# Altium project Service_board.PrjPcb (part 8 of 9)
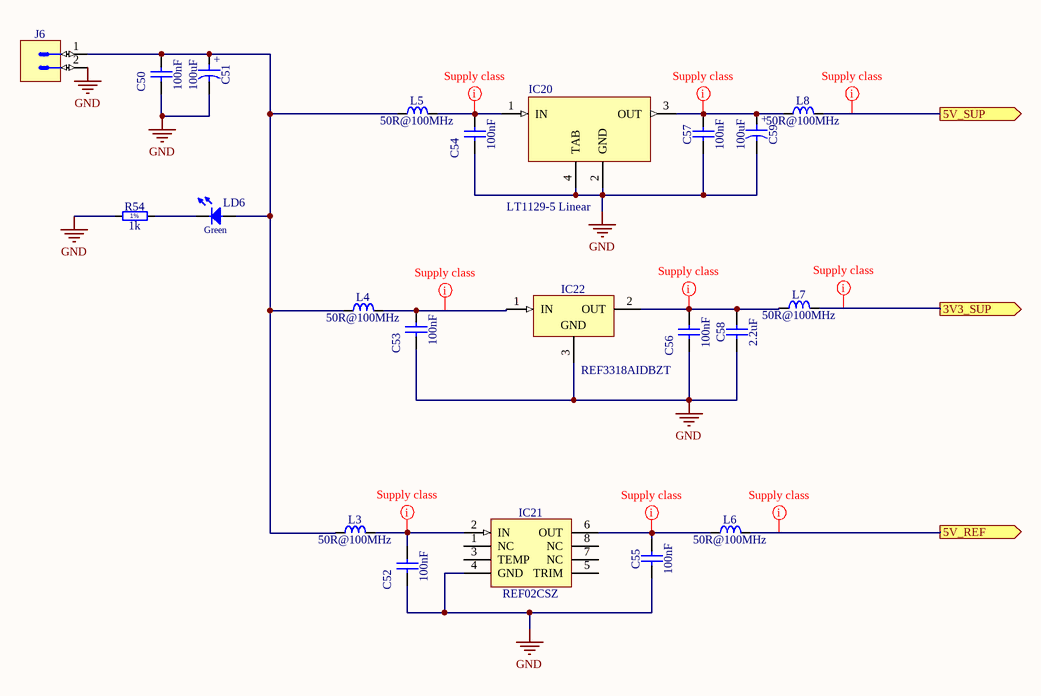
[diagram p13: Regulators.SchDoc]

## Nets that join several sheets (continued)
NetIC2_U_Bank_U_Channel#11_7: U_Bank/U_Channel (IC2_U_Bank_U_Channel#11.7), U_Bank/U_Channel/U_Switch (IC13_U_Bank_U_Channel_U_Switch#22.4 R33_U_Bank_U_Channel_U_Switch#22.2)
NetIC2_U_Bank_U_Channel#11_8: U_Bank/U_Channel (IC2_U_Bank_U_Channel#11.8), U_Bank/U_Channel/U_Switch (IC15_U_Bank_U_Channel_U_Switch#21.5 LD5_U_Bank_U_Channel_U_Switch#21.2 T7_U_Bank_U_Channel_U_Switch#21.1)
NetIC2_U_Bank_U_Channel#11_11: U_Bank/U_Channel (IC2_U_Bank_U_Channel#11.11), U_Bank/U_Channel/U_Switch (IC15_U_Bank_U_Channel_U_Switch#22.5 LD5_U_Bank_U_Channel_U_Switch#22.2 T7_U_Bank_U_Channel_U_Switch#22.1)
NetIC2_U_Bank_U_Channel#11_14: U_Bank/U_Channel (IC2_U_Bank_U_Channel#11.14), U_Bank/U_Channel/U_Switch (IC13_U_Bank_U_Channel_U_Switch#21.4 R33_U_Bank_U_Channel_U_Switch#21.2)
NetIC2_U_Bank_U_Channel#11_16: U_Bank/U_Channel (IC2_U_Bank_U_Channel#11.16), U_Bank/U_Channel/U_Switch (R45_U_Bank_U_Channel_U_Switch#21.2)
NetIC2_U_Bank_U_Channel#11_18: U_Bank/U_Channel (IC2_U_Bank_U_Channel#11.18), U_Bank/U_Channel/U_Switch (R46_U_Bank_U_Channel_U_Switch#21.2)
NetIC2_U_Bank_U_Channel#12_3: U_Bank/U_Channel (IC2_U_Bank_U_Channel#12.3), U_Bank/U_Channel/U_Switch (R46_U_Bank_U_Channel_U_Switch#24.2)
NetIC2_U_Bank_U_Channel#12_5: U_Bank/U_Channel (IC2_U_Bank_U_Channel#12.5), U_Bank/U_Channel/U_Switch (R45_U_Bank_U_Channel_U_Switch#24.2)
NetIC2_U_Bank_U_Channel#12_7: U_Bank/U_Channel (IC2_U_Bank_U_Channel#12.7), U_Bank/U_Channel/U_Switch (IC13_U_Bank_U_Channel_U_Switch#24.4 R33_U_Bank_U_Channel_U_Switch#24.2)
NetIC2_U_Bank_U_Channel#12_8: U_Bank/U_Channel (IC2_U_Bank_U_Channel#12.8), U_Bank/U_Channel/U_Switch (IC15_U_Bank_U_Channel_U_Switch#23.5 LD5_U_Bank_U_Channel_U_Switch#23.2 T7_U_Bank_U_Channel_U_Switch#23.1)
NetIC2_U_Bank_U_Channel#12_11: U_Bank/U_Channel (IC2_U_Bank_U_Channel#12.11), U_Bank/U_Channel/U_Switch (IC15_U_Bank_U_Channel_U_Switch#24.5 LD5_U_Bank_U_Channel_U_Switch#24.2 T7_U_Bank_U_Channel_U_Switch#24.1)
NetIC2_U_Bank_U_Channel#12_14: U_Bank/U_Channel (IC2_U_Bank_U_Channel#12.14), U_Bank/U_Channel/U_Switch (IC13_U_Bank_U_Channel_U_Switch#23.4 R33_U_Bank_U_Channel_U_Switch#23.2)
NetIC2_U_Bank_U_Channel#12_16: U_Bank/U_Channel (IC2_U_Bank_U_Channel#12.16), U_Bank/U_Channel/U_Switch (R45_U_Bank_U_Channel_U_Switch#23.2)
NetIC2_U_Bank_U_Channel#12_18: U_Bank/U_Channel (IC2_U_Bank_U_Channel#12.18), U_Bank/U_Channel/U_Switch (R46_U_Bank_U_Channel_U_Switch#23.2)
NetIC2_U_Bank_U_Channel#13_3: U_Bank/U_Channel (IC2_U_Bank_U_Channel#13.3), U_Bank/U_Channel/U_Switch (R46_U_Bank_U_Channel_U_Switch#26.2)
NetIC2_U_Bank_U_Channel#13_5: U_Bank/U_Channel (IC2_U_Bank_U_Channel#13.5), U_Bank/U_Channel/U_Switch (R45_U_Bank_U_Channel_U_Switch#26.2)
NetIC2_U_Bank_U_Channel#13_7: U_Bank/U_Channel (IC2_U_Bank_U_Channel#13.7), U_Bank/U_Channel/U_Switch (IC13_U_Bank_U_Channel_U_Switch#26.4 R33_U_Bank_U_Channel_U_Switch#26.2)
NetIC2_U_Bank_U_Channel#13_8: U_Bank/U_Channel (IC2_U_Bank_U_Channel#13.8), U_Bank/U_Channel/U_Switch (IC15_U_Bank_U_Channel_U_Switch#25.5 LD5_U_Bank_U_Channel_U_Switch#25.2 T7_U_Bank_U_Channel_U_Switch#25.1)
NetIC2_U_Bank_U_Channel#13_11: U_Bank/U_Channel (IC2_U_Bank_U_Channel#13.11), U_Bank/U_Channel/U_Switch (IC15_U_Bank_U_Channel_U_Switch#26.5 LD5_U_Bank_U_Channel_U_Switch#26.2 T7_U_Bank_U_Channel_U_Switch#26.1)
NetIC2_U_Bank_U_Channel#13_14: U_Bank/U_Channel (IC2_U_Bank_U_Channel#13.14), U_Bank/U_Channel/U_Switch (IC13_U_Bank_U_Channel_U_Switch#25.4 R33_U_Bank_U_Channel_U_Switch#25.2)
NetIC2_U_Bank_U_Channel#13_16: U_Bank/U_Channel (IC2_U_Bank_U_Channel#13.16), U_Bank/U_Channel/U_Switch (R45_U_Bank_U_Channel_U_Switch#25.2)
NetIC2_U_Bank_U_Channel#13_18: U_Bank/U_Channel (IC2_U_Bank_U_Channel#13.18), U_Bank/U_Channel/U_Switch (R46_U_Bank_U_Channel_U_Switch#25.2)
NetIC2_U_Bank_U_Channel#14_3: U_Bank/U_Channel (IC2_U_Bank_U_Channel#14.3), U_Bank/U_Channel/U_Switch (R46_U_Bank_U_Channel_U_Switch#28.2)
NetIC2_U_Bank_U_Channel#14_5: U_Bank/U_Channel (IC2_U_Bank_U_Channel#14.5), U_Bank/U_Channel/U_Switch (R45_U_Bank_U_Channel_U_Switch#28.2)
NetIC2_U_Bank_U_Channel#14_7: U_Bank/U_Channel (IC2_U_Bank_U_Channel#14.7), U_Bank/U_Channel/U_Switch (IC13_U_Bank_U_Channel_U_Switch#28.4 R33_U_Bank_U_Channel_U_Switch#28.2)
NetIC2_U_Bank_U_Channel#14_8: U_Bank/U_Channel (IC2_U_Bank_U_Channel#14.8), U_Bank/U_Channel/U_Switch (IC15_U_Bank_U_Channel_U_Switch#27.5 LD5_U_Bank_U_Channel_U_Switch#27.2 T7_U_Bank_U_Channel_U_Switch#27.1)
NetIC2_U_Bank_U_Channel#14_11: U_Bank/U_Channel (IC2_U_Bank_U_Channel#14.11), U_Bank/U_Channel/U_Switch (IC15_U_Bank_U_Channel_U_Switch#28.5 LD5_U_Bank_U_Channel_U_Switch#28.2 T7_U_Bank_U_Channel_U_Switch#28.1)
NetIC2_U_Bank_U_Channel#14_14: U_Bank/U_Channel (IC2_U_Bank_U_Channel#14.14), U_Bank/U_Channel/U_Switch (IC13_U_Bank_U_Channel_U_Switch#27.4 R33_U_Bank_U_Channel_U_Switch#27.2)
NetIC2_U_Bank_U_Channel#14_16: U_Bank/U_Channel (IC2_U_Bank_U_Channel#14.16), U_Bank/U_Channel/U_Switch (R45_U_Bank_U_Channel_U_Switch#27.2)
NetIC2_U_Bank_U_Channel#14_18: U_Bank/U_Channel (IC2_U_Bank_U_Channel#14.18), U_Bank/U_Channel/U_Switch (R46_U_Bank_U_Channel_U_Switch#27.2)
NetIC2_U_Bank_U_Channel#15_3: U_Bank/U_Channel (IC2_U_Bank_U_Channel#15.3), U_Bank/U_Channel/U_Switch (R46_U_Bank_U_Channel_U_Switch#30.2)
NetIC2_U_Bank_U_Channel#15_5: U_Bank/U_Channel (IC2_U_Bank_U_Channel#15.5), U_Bank/U_Channel/U_Switch (R45_U_Bank_U_Channel_U_Switch#30.2)
NetIC2_U_Bank_U_Channel#15_7: U_Bank/U_Channel (IC2_U_Bank_U_Channel#15.7), U_Bank/U_Channel/U_Switch (IC13_U_Bank_U_Channel_U_Switch#30.4 R33_U_Bank_U_Channel_U_Switch#30.2)
NetIC2_U_Bank_U_Channel#15_8: U_Bank/U_Channel (IC2_U_Bank_U_Channel#15.8), U_Bank/U_Channel/U_Switch (IC15_U_Bank_U_Channel_U_Switch#29.5 LD5_U_Bank_U_Channel_U_Switch#29.2 T7_U_Bank_U_Channel_U_Switch#29.1)
NetIC2_U_Bank_U_Channel#15_11: U_Bank/U_Channel (IC2_U_Bank_U_Channel#15.11), U_Bank/U_Channel/U_Switch (IC15_U_Bank_U_Channel_U_Switch#30.5 LD5_U_Bank_U_Channel_U_Switch#30.2 T7_U_Bank_U_Channel_U_Switch#30.1)
NetIC2_U_Bank_U_Channel#15_14: U_Bank/U_Channel (IC2_U_Bank_U_Channel#15.14), U_Bank/U_Channel/U_Switch (IC13_U_Bank_U_Channel_U_Switch#29.4 R33_U_Bank_U_Channel_U_Switch#29.2)
NetIC2_U_Bank_U_Channel#15_16: U_Bank/U_Channel (IC2_U_Bank_U_Channel#15.16), U_Bank/U_Channel/U_Switch (R45_U_Bank_U_Channel_U_Switch#29.2)
NetIC2_U_Bank_U_Channel#15_18: U_Bank/U_Channel (IC2_U_Bank_U_Channel#15.18), U_Bank/U_Channel/U_Switch (R46_U_Bank_U_Channel_U_Switch#29.2)
NetIC2_U_Bank_U_Channel#16_3: U_Bank/U_Channel (IC2_U_Bank_U_Channel#16.3), U_Bank/U_Channel/U_Switch (R46_U_Bank_U_Channel_U_Switch#32.2)
NetIC2_U_Bank_U_Channel#16_5: U_Bank/U_Channel (IC2_U_Bank_U_Channel#16.5), U_Bank/U_Channel/U_Switch (R45_U_Bank_U_Channel_U_Switch#32.2)
NetIC2_U_Bank_U_Channel#16_7: U_Bank/U_Channel (IC2_U_Bank_U_Channel#16.7), U_Bank/U_Channel/U_Switch (IC13_U_Bank_U_Channel_U_Switch#32.4 R33_U_Bank_U_Channel_U_Switch#32.2)
NetIC2_U_Bank_U_Channel#16_8: U_Bank/U_Channel (IC2_U_Bank_U_Channel#16.8), U_Bank/U_Channel/U_Switch (IC15_U_Bank_U_Channel_U_Switch#31.5 LD5_U_Bank_U_Channel_U_Switch#31.2 T7_U_Bank_U_Channel_U_Switch#31.1)
NetIC2_U_Bank_U_Channel#16_11: U_Bank/U_Channel (IC2_U_Bank_U_Channel#16.11), U_Bank/U_Channel/U_Switch (IC15_U_Bank_U_Channel_U_Switch#32.5 LD5_U_Bank_U_Channel_U_Switch#32.2 T7_U_Bank_U_Channel_U_Switch#32.1)
NetIC2_U_Bank_U_Channel#16_14: U_Bank/U_Channel (IC2_U_Bank_U_Channel#16.14), U_Bank/U_Channel/U_Switch (IC13_U_Bank_U_Channel_U_Switch#31.4 R33_U_Bank_U_Channel_U_Switch#31.2)
NetIC2_U_Bank_U_Channel#16_16: U_Bank/U_Channel (IC2_U_Bank_U_Channel#16.16), U_Bank/U_Channel/U_Switch (R45_U_Bank_U_Channel_U_Switch#31.2)
NetIC2_U_Bank_U_Channel#16_18: U_Bank/U_Channel (IC2_U_Bank_U_Channel#16.18), U_Bank/U_Channel/U_Switch (R46_U_Bank_U_Channel_U_Switch#31.2)
NetIC2_U_Bank_U_Channel#17_3: U_Bank/U_Channel (IC2_U_Bank_U_Channel#17.3), U_Bank/U_Channel/U_Switch (R46_U_Bank_U_Channel_U_Switch#34.2)
NetIC2_U_Bank_U_Channel#17_5: U_Bank/U_Channel (IC2_U_Bank_U_Channel#17.5), U_Bank/U_Channel/U_Switch (R45_U_Bank_U_Channel_U_Switch#34.2)
NetIC2_U_Bank_U_Channel#17_7: U_Bank/U_Channel (IC2_U_Bank_U_Channel#17.7), U_Bank/U_Channel/U_Switch (IC13_U_Bank_U_Channel_U_Switch#34.4 R33_U_Bank_U_Channel_U_Switch#34.2)
NetIC2_U_Bank_U_Channel#17_8: U_Bank/U_Channel (IC2_U_Bank_U_Channel#17.8), U_Bank/U_Channel/U_Switch (IC15_U_Bank_U_Channel_U_Switch#33.5 LD5_U_Bank_U_Channel_U_Switch#33.2 T7_U_Bank_U_Channel_U_Switch#33.1)
NetIC2_U_Bank_U_Channel#17_11: U_Bank/U_Channel (IC2_U_Bank_U_Channel#17.11), U_Bank/U_Channel/U_Switch (IC15_U_Bank_U_Channel_U_Switch#34.5 LD5_U_Bank_U_Channel_U_Switch#34.2 T7_U_Bank_U_Channel_U_Switch#34.1)
NetIC2_U_Bank_U_Channel#17_14: U_Bank/U_Channel (IC2_U_Bank_U_Channel#17.14), U_Bank/U_Channel/U_Switch (IC13_U_Bank_U_Channel_U_Switch#33.4 R33_U_Bank_U_Channel_U_Switch#33.2)
NetIC2_U_Bank_U_Channel#17_16: U_Bank/U_Channel (IC2_U_Bank_U_Channel#17.16), U_Bank/U_Channel/U_Switch (R45_U_Bank_U_Channel_U_Switch#33.2)
NetIC2_U_Bank_U_Channel#17_18: U_Bank/U_Channel (IC2_U_Bank_U_Channel#17.18), U_Bank/U_Channel/U_Switch (R46_U_Bank_U_Channel_U_Switch#33.2)
NetIC2_U_Bank_U_Channel#18_3: U_Bank/U_Channel (IC2_U_Bank_U_Channel#18.3), U_Bank/U_Channel/U_Switch (R46_U_Bank_U_Channel_U_Switch#36.2)
NetIC2_U_Bank_U_Channel#18_5: U_Bank/U_Channel (IC2_U_Bank_U_Channel#18.5), U_Bank/U_Channel/U_Switch (R45_U_Bank_U_Channel_U_Switch#36.2)
NetIC2_U_Bank_U_Channel#18_7: U_Bank/U_Channel (IC2_U_Bank_U_Channel#18.7), U_Bank/U_Channel/U_Switch (IC13_U_Bank_U_Channel_U_Switch#36.4 R33_U_Bank_U_Channel_U_Switch#36.2)
NetIC2_U_Bank_U_Channel#18_8: U_Bank/U_Channel (IC2_U_Bank_U_Channel#18.8), U_Bank/U_Channel/U_Switch (IC15_U_Bank_U_Channel_U_Switch#35.5 LD5_U_Bank_U_Channel_U_Switch#35.2 T7_U_Bank_U_Channel_U_Switch#35.1)
NetIC2_U_Bank_U_Channel#18_11: U_Bank/U_Channel (IC2_U_Bank_U_Channel#18.11), U_Bank/U_Channel/U_Switch (IC15_U_Bank_U_Channel_U_Switch#36.5 LD5_U_Bank_U_Channel_U_Switch#36.2 T7_U_Bank_U_Channel_U_Switch#36.1)
NetIC2_U_Bank_U_Channel#18_14: U_Bank/U_Channel (IC2_U_Bank_U_Channel#18.14), U_Bank/U_Channel/U_Switch (IC13_U_Bank_U_Channel_U_Switch#35.4 R33_U_Bank_U_Channel_U_Switch#35.2)
NetIC2_U_Bank_U_Channel#18_16: U_Bank/U_Channel (IC2_U_Bank_U_Channel#18.16), U_Bank/U_Channel/U_Switch (R45_U_Bank_U_Channel_U_Switch#35.2)
NetIC2_U_Bank_U_Channel#18_18: U_Bank/U_Channel (IC2_U_Bank_U_Channel#18.18), U_Bank/U_Channel/U_Switch (R46_U_Bank_U_Channel_U_Switch#35.2)
NetIC2_U_Bank_U_Channel#19_3: U_Bank/U_Channel (IC2_U_Bank_U_Channel#19.3), U_Bank/U_Channel/U_Switch (R46_U_Bank_U_Channel_U_Switch#38.2)
NetIC2_U_Bank_U_Channel#19_5: U_Bank/U_Channel (IC2_U_Bank_U_Channel#19.5), U_Bank/U_Channel/U_Switch (R45_U_Bank_U_Channel_U_Switch#38.2)
NetIC2_U_Bank_U_Channel#19_7: U_Bank/U_Channel (IC2_U_Bank_U_Channel#19.7), U_Bank/U_Channel/U_Switch (IC13_U_Bank_U_Channel_U_Switch#38.4 R33_U_Bank_U_Channel_U_Switch#38.2)
NetIC2_U_Bank_U_Channel#19_8: U_Bank/U_Channel (IC2_U_Bank_U_Channel#19.8), U_Bank/U_Channel/U_Switch (IC15_U_Bank_U_Channel_U_Switch#37.5 LD5_U_Bank_U_Channel_U_Switch#37.2 T7_U_Bank_U_Channel_U_Switch#37.1)
NetIC2_U_Bank_U_Channel#19_11: U_Bank/U_Channel (IC2_U_Bank_U_Channel#19.11), U_Bank/U_Channel/U_Switch (IC15_U_Bank_U_Channel_U_Switch#38.5 LD5_U_Bank_U_Channel_U_Switch#38.2 T7_U_Bank_U_Channel_U_Switch#38.1)
NetIC2_U_Bank_U_Channel#19_14: U_Bank/U_Channel (IC2_U_Bank_U_Channel#19.14), U_Bank/U_Channel/U_Switch (IC13_U_Bank_U_Channel_U_Switch#37.4 R33_U_Bank_U_Channel_U_Switch#37.2)
NetIC2_U_Bank_U_Channel#19_16: U_Bank/U_Channel (IC2_U_Bank_U_Channel#19.16), U_Bank/U_Channel/U_Switch (R45_U_Bank_U_Channel_U_Switch#37.2)
NetIC2_U_Bank_U_Channel#19_18: U_Bank/U_Channel (IC2_U_Bank_U_Channel#19.18), U_Bank/U_Channel/U_Switch (R46_U_Bank_U_Channel_U_Switch#37.2)
NetIC2_U_Bank_U_Channel#20_3: U_Bank/U_Channel (IC2_U_Bank_U_Channel#20.3), U_Bank/U_Channel/U_Switch (R46_U_Bank_U_Channel_U_Switch#40.2)
NetIC2_U_Bank_U_Channel#20_5: U_Bank/U_Channel (IC2_U_Bank_U_Channel#20.5), U_Bank/U_Channel/U_Switch (R45_U_Bank_U_Channel_U_Switch#40.2)
NetIC2_U_Bank_U_Channel#20_7: U_Bank/U_Channel (IC2_U_Bank_U_Channel#20.7), U_Bank/U_Channel/U_Switch (IC13_U_Bank_U_Channel_U_Switch#40.4 R33_U_Bank_U_Channel_U_Switch#40.2)
NetIC2_U_Bank_U_Channel#20_8: U_Bank/U_Channel (IC2_U_Bank_U_Channel#20.8), U_Bank/U_Channel/U_Switch (IC15_U_Bank_U_Channel_U_Switch#39.5 LD5_U_Bank_U_Channel_U_Switch#39.2 T7_U_Bank_U_Channel_U_Switch#39.1)
NetIC2_U_Bank_U_Channel#20_11: U_Bank/U_Channel (IC2_U_Bank_U_Channel#20.11), U_Bank/U_Channel/U_Switch (IC15_U_Bank_U_Channel_U_Switch#40.5 LD5_U_Bank_U_Channel_U_Switch#40.2 T7_U_Bank_U_Channel_U_Switch#40.1)
NetIC2_U_Bank_U_Channel#20_14: U_Bank/U_Channel (IC2_U_Bank_U_Channel#20.14), U_Bank/U_Channel/U_Switch (IC13_U_Bank_U_Channel_U_Switch#39.4 R33_U_Bank_U_Channel_U_Switch#39.2)
NetIC2_U_Bank_U_Channel#20_16: U_Bank/U_Channel (IC2_U_Bank_U_Channel#20.16), U_Bank/U_Channel/U_Switch (R45_U_Bank_U_Channel_U_Switch#39.2)
NetIC2_U_Bank_U_Channel#20_18: U_Bank/U_Channel (IC2_U_Bank_U_Channel#20.18), U_Bank/U_Channel/U_Switch (R46_U_Bank_U_Channel_U_Switch#39.2)
NetIC2_U_Bank_U_Channel#21_3: U_Bank/U_Channel (IC2_U_Bank_U_Channel#21.3), U_Bank/U_Channel/U_Switch (R46_U_Bank_U_Channel_U_Switch#42.2)
NetIC2_U_Bank_U_Channel#21_5: U_Bank/U_Channel (IC2_U_Bank_U_Channel#21.5), U_Bank/U_Channel/U_Switch (R45_U_Bank_U_Channel_U_Switch#42.2)
NetIC2_U_Bank_U_Channel#21_7: U_Bank/U_Channel (IC2_U_Bank_U_Channel#21.7), U_Bank/U_Channel/U_Switch (IC13_U_Bank_U_Channel_U_Switch#42.4 R33_U_Bank_U_Channel_U_Switch#42.2)
NetIC2_U_Bank_U_Channel#21_8: U_Bank/U_Channel (IC2_U_Bank_U_Channel#21.8), U_Bank/U_Channel/U_Switch (IC15_U_Bank_U_Channel_U_Switch#41.5 LD5_U_Bank_U_Channel_U_Switch#41.2 T7_U_Bank_U_Channel_U_Switch#41.1)
NetIC2_U_Bank_U_Channel#21_11: U_Bank/U_Channel (IC2_U_Bank_U_Channel#21.11), U_Bank/U_Channel/U_Switch (IC15_U_Bank_U_Channel_U_Switch#42.5 LD5_U_Bank_U_Channel_U_Switch#42.2 T7_U_Bank_U_Channel_U_Switch#42.1)
NetIC2_U_Bank_U_Channel#21_14: U_Bank/U_Channel (IC2_U_Bank_U_Channel#21.14), U_Bank/U_Channel/U_Switch (IC13_U_Bank_U_Channel_U_Switch#41.4 R33_U_Bank_U_Channel_U_Switch#41.2)
NetIC2_U_Bank_U_Channel#21_16: U_Bank/U_Channel (IC2_U_Bank_U_Channel#21.16), U_Bank/U_Channel/U_Switch (R45_U_Bank_U_Channel_U_Switch#41.2)
NetIC2_U_Bank_U_Channel#21_18: U_Bank/U_Channel (IC2_U_Bank_U_Channel#21.18), U_Bank/U_Channel/U_Switch (R46_U_Bank_U_Channel_U_Switch#41.2)
NetIC2_U_Bank_U_Channel#22_3: U_Bank/U_Channel (IC2_U_Bank_U_Channel#22.3), U_Bank/U_Channel/U_Switch (R46_U_Bank_U_Channel_U_Switch#44.2)
NetIC2_U_Bank_U_Channel#22_5: U_Bank/U_Channel (IC2_U_Bank_U_Channel#22.5), U_Bank/U_Channel/U_Switch (R45_U_Bank_U_Channel_U_Switch#44.2)
NetIC2_U_Bank_U_Channel#22_7: U_Bank/U_Channel (IC2_U_Bank_U_Channel#22.7), U_Bank/U_Channel/U_Switch (IC13_U_Bank_U_Channel_U_Switch#44.4 R33_U_Bank_U_Channel_U_Switch#44.2)
NetIC2_U_Bank_U_Channel#22_8: U_Bank/U_Channel (IC2_U_Bank_U_Channel#22.8), U_Bank/U_Channel/U_Switch (IC15_U_Bank_U_Channel_U_Switch#43.5 LD5_U_Bank_U_Channel_U_Switch#43.2 T7_U_Bank_U_Channel_U_Switch#43.1)
NetIC2_U_Bank_U_Channel#22_11: U_Bank/U_Channel (IC2_U_Bank_U_Channel#22.11), U_Bank/U_Channel/U_Switch (IC15_U_Bank_U_Channel_U_Switch#44.5 LD5_U_Bank_U_Channel_U_Switch#44.2 T7_U_Bank_U_Channel_U_Switch#44.1)
NetIC2_U_Bank_U_Channel#22_14: U_Bank/U_Channel (IC2_U_Bank_U_Channel#22.14), U_Bank/U_Channel/U_Switch (IC13_U_Bank_U_Channel_U_Switch#43.4 R33_U_Bank_U_Channel_U_Switch#43.2)
NetIC2_U_Bank_U_Channel#22_16: U_Bank/U_Channel (IC2_U_Bank_U_Channel#22.16), U_Bank/U_Channel/U_Switch (R45_U_Bank_U_Channel_U_Switch#43.2)
NetIC2_U_Bank_U_Channel#22_18: U_Bank/U_Channel (IC2_U_Bank_U_Channel#22.18), U_Bank/U_Channel/U_Switch (R46_U_Bank_U_Channel_U_Switch#43.2)
NetIC2_U_Bank_U_Channel#23_3: U_Bank/U_Channel (IC2_U_Bank_U_Channel#23.3), U_Bank/U_Channel/U_Switch (R46_U_Bank_U_Channel_U_Switch#46.2)
NetIC2_U_Bank_U_Channel#23_5: U_Bank/U_Channel (IC2_U_Bank_U_Channel#23.5), U_Bank/U_Channel/U_Switch (R45_U_Bank_U_Channel_U_Switch#46.2)
NetIC2_U_Bank_U_Channel#23_7: U_Bank/U_Channel (IC2_U_Bank_U_Channel#23.7), U_Bank/U_Channel/U_Switch (IC13_U_Bank_U_Channel_U_Switch#46.4 R33_U_Bank_U_Channel_U_Switch#46.2)
NetIC2_U_Bank_U_Channel#23_8: U_Bank/U_Channel (IC2_U_Bank_U_Channel#23.8), U_Bank/U_Channel/U_Switch (IC15_U_Bank_U_Channel_U_Switch#45.5 LD5_U_Bank_U_Channel_U_Switch#45.2 T7_U_Bank_U_Channel_U_Switch#45.1)
NetIC2_U_Bank_U_Channel#23_11: U_Bank/U_Channel (IC2_U_Bank_U_Channel#23.11), U_Bank/U_Channel/U_Switch (IC15_U_Bank_U_Channel_U_Switch#46.5 LD5_U_Bank_U_Channel_U_Switch#46.2 T7_U_Bank_U_Channel_U_Switch#46.1)
NetIC2_U_Bank_U_Channel#23_14: U_Bank/U_Channel (IC2_U_Bank_U_Channel#23.14), U_Bank/U_Channel/U_Switch (IC13_U_Bank_U_Channel_U_Switch#45.4 R33_U_Bank_U_Channel_U_Switch#45.2)
NetIC2_U_Bank_U_Channel#23_16: U_Bank/U_Channel (IC2_U_Bank_U_Channel#23.16), U_Bank/U_Channel/U_Switch (R45_U_Bank_U_Channel_U_Switch#45.2)
NetIC2_U_Bank_U_Channel#23_18: U_Bank/U_Channel (IC2_U_Bank_U_Channel#23.18), U_Bank/U_Channel/U_Switch (R46_U_Bank_U_Channel_U_Switch#45.2)
NetIC2_U_Bank_U_Channel#24_3: U_Bank/U_Channel (IC2_U_Bank_U_Channel#24.3), U_Bank/U_Channel/U_Switch (R46_U_Bank_U_Channel_U_Switch#48.2)
NetIC2_U_Bank_U_Channel#24_5: U_Bank/U_Channel (IC2_U_Bank_U_Channel#24.5), U_Bank/U_Channel/U_Switch (R45_U_Bank_U_Channel_U_Switch#48.2)
NetIC2_U_Bank_U_Channel#24_7: U_Bank/U_Channel (IC2_U_Bank_U_Channel#24.7), U_Bank/U_Channel/U_Switch (IC13_U_Bank_U_Channel_U_Switch#48.4 R33_U_Bank_U_Channel_U_Switch#48.2)
NetIC2_U_Bank_U_Channel#24_8: U_Bank/U_Channel (IC2_U_Bank_U_Channel#24.8), U_Bank/U_Channel/U_Switch (IC15_U_Bank_U_Channel_U_Switch#47.5 LD5_U_Bank_U_Channel_U_Switch#47.2 T7_U_Bank_U_Channel_U_Switch#47.1)
NetIC2_U_Bank_U_Channel#24_11: U_Bank/U_Channel (IC2_U_Bank_U_Channel#24.11), U_Bank/U_Channel/U_Switch (IC15_U_Bank_U_Channel_U_Switch#48.5 LD5_U_Bank_U_Channel_U_Switch#48.2 T7_U_Bank_U_Channel_U_Switch#48.1)
NetIC2_U_Bank_U_Channel#24_14: U_Bank/U_Channel (IC2_U_Bank_U_Channel#24.14), U_Bank/U_Channel/U_Switch (IC13_U_Bank_U_Channel_U_Switch#47.4 R33_U_Bank_U_Channel_U_Switch#47.2)
NetIC2_U_Bank_U_Channel#24_16: U_Bank/U_Channel (IC2_U_Bank_U_Channel#24.16), U_Bank/U_Channel/U_Switch (R45_U_Bank_U_Channel_U_Switch#47.2)
NetIC2_U_Bank_U_Channel#24_18: U_Bank/U_Channel (IC2_U_Bank_U_Channel#24.18), U_Bank/U_Channel/U_Switch (R46_U_Bank_U_Channel_U_Switch#47.2)
NetIC8_20: MCU (IC8.20), DAC (IC18.9)
NetIC8_21: MCU (IC8.21), DAC (IC18.10)
NetIC8_22: MCU (IC8.22), DAC (IC18.11)
NetIC8_23: MCU (IC8.23), U_Bank/U_Channel/U_Switch (IC13_U_Bank_U_Channel_U_Switch#1.1), U_Bank/U_Channel/U_Switch (IC13_U_Bank_U_Channel_U_Switch#2.1), U_Bank/U_Channel/U_Switch (IC13_U_Bank_U_Channel_U_Switch#3.1), U_Bank/U_Channel/U_Switch (IC13_U_Bank_U_Channel_U_Switch#4.1), U_Bank/U_Channel/U_Switch (IC13_U_Bank_U_Channel_U_Switch#5.1), U_Bank/U_Channel/U_Switch (IC13_U_Bank_U_Channel_U_Switch#6.1), U_Bank/U_Channel/U_Switch (IC13_U_Bank_U_Channel_U_Switch#7.1), U_Bank/U_Channel/U_Switch (IC13_U_Bank_U_Channel_U_Switch#8.1), U_Bank/U_Channel/U_Switch (IC13_U_Bank_U_Channel_U_Switch#9.1), U_Bank/U_Channel/U_Switch (IC13_U_Bank_U_Channel_U_Switch#10.1), U_Bank/U_Channel/U_Switch (IC13_U_Bank_U_Channel_U_Switch#11.1), U_Bank/U_Channel/U_Switch (IC13_U_Bank_U_Channel_U_Switch#12.1), U_Bank/U_Channel/U_Switch (IC13_U_Bank_U_Channel_U_Switch#13.1), U_Bank/U_Channel/U_Switch (IC13_U_Bank_U_Channel_U_Switch#14.1), U_Bank/U_Channel/U_Switch (IC13_U_Bank_U_Channel_U_Switch#15.1), U_Bank/U_Channel/U_Switch (IC13_U_Bank_U_Channel_U_Switch#16.1), U_Bank/U_Channel/U_Switch (IC13_U_Bank_U_Channel_U_Switch#17.1), U_Bank/U_Channel/U_Switch (IC13_U_Bank_U_Channel_U_Switch#18.1), U_Bank/U_Channel/U_Switch (IC13_U_Bank_U_Channel_U_Switch#19.1), U_Bank/U_Channel/U_Switch (IC13_U_Bank_U_Channel_U_Switch#20.1), U_Bank/U_Channel/U_Switch (IC13_U_Bank_U_Channel_U_Switch#21.1), U_Bank/U_Channel/U_Switch (IC13_U_Bank_U_Channel_U_Switch#22.1), U_Bank/U_Channel/U_Switch (IC13_U_Bank_U_Channel_U_Switch#23.1), U_Bank/U_Channel/U_Switch (IC13_U_Bank_U_Channel_U_Switch#24.1), U_Bank/U_Channel/U_Switch (IC13_U_Bank_U_Channel_U_Switch#25.1), U_Bank/U_Channel/U_Switch (IC13_U_Bank_U_Channel_U_Switch#26.1), U_Bank/U_Channel/U_Switch (IC13_U_Bank_U_Channel_U_Switch#27.1), U_Bank/U_Channel/U_Switch (IC13_U_Bank_U_Channel_U_Switch#28.1), U_Bank/U_Channel/U_Switch (IC13_U_Bank_U_Channel_U_Switch#29.1), U_Bank/U_Channel/U_Switch (IC13_U_Bank_U_Channel_U_Switch#30.1), U_Bank/U_Channel/U_Switch (IC13_U_Bank_U_Channel_U_Switch#31.1), U_Bank/U_Channel/U_Switch (IC13_U_Bank_U_Channel_U_Switch#32.1), U_Bank/U_Channel/U_Switch (IC13_U_Bank_U_Channel_U_Switch#33.1), U_Bank/U_Channel/U_Switch (IC13_U_Bank_U_Channel_U_Switch#34.1), U_Bank/U_Channel/U_Switch (IC13_U_Bank_U_Channel_U_Switch#35.1), U_Bank/U_Channel/U_Switch (IC13_U_Bank_U_Channel_U_Switch#36.1), U_Bank/U_Channel/U_Switch (IC13_U_Bank_U_Channel_U_Switch#37.1), U_Bank/U_Channel/U_Switch (IC13_U_Bank_U_Channel_U_Switch#38.1), U_Bank/U_Channel/U_Switch (IC13_U_Bank_U_Channel_U_Switch#39.1), U_Bank/U_Channel/U_Switch (IC13_U_Bank_U_Channel_U_Switch#40.1), U_Bank/U_Channel/U_Switch (IC13_U_Bank_U_Channel_U_Switch#41.1), U_Bank/U_Channel/U_Switch (IC13_U_Bank_U_Channel_U_Switch#42.1), U_Bank/U_Channel/U_Switch (IC13_U_Bank_U_Channel_U_Switch#43.1), U_Bank/U_Channel/U_Switch (IC13_U_Bank_U_Channel_U_Switch#44.1), U_Bank/U_Channel/U_Switch (IC13_U_Bank_U_Channel_U_Switch#45.1), U_Bank/U_Channel/U_Switch (IC13_U_Bank_U_Channel_U_Switch#46.1), U_Bank/U_Channel/U_Switch (IC13_U_Bank_U_Channel_U_Switch#47.1), U_Bank/U_Channel/U_Switch (IC13_U_Bank_U_Channel_U_Switch#48.1)
NetIC8_33: MCU (IC8.33), U_Bank/U_Channel/U_TRD (U2_U_Bank_U_Channel_U_TRD#1.18), U_Bank/U_Channel/U_TRD (U2_U_Bank_U_Channel_U_TRD#2.18), U_Bank/U_Channel/U_TRD (U2_U_Bank_U_Channel_U_TRD#3.18), U_Bank/U_Channel/U_TRD (U2_U_Bank_U_Channel_U_TRD#4.18), U_Bank/U_Channel/U_TRD (U2_U_Bank_U_Channel_U_TRD#5.18), U_Bank/U_Channel/U_TRD (U2_U_Bank_U_Channel_U_TRD#6.18), U_Bank/U_Channel/U_TRD (U2_U_Bank_U_Channel_U_TRD#7.18), U_Bank/U_Channel/U_TRD (U2_U_Bank_U_Channel_U_TRD#8.18), U_Bank/U_Channel/U_TRD (U2_U_Bank_U_Channel_U_TRD#9.18), U_Bank/U_Channel/U_TRD (U2_U_Bank_U_Channel_U_TRD#10.18), U_Bank/U_Channel/U_TRD (U2_U_Bank_U_Channel_U_TRD#11.18), U_Bank/U_Channel/U_TRD (U2_U_Bank_U_Channel_U_TRD#12.18), U_Bank/U_Channel/U_TRD (U2_U_Bank_U_Channel_U_TRD#13.18), U_Bank/U_Channel/U_TRD (U2_U_Bank_U_Channel_U_TRD#14.18), U_Bank/U_Channel/U_TRD (U2_U_Bank_U_Channel_U_TRD#15.18), U_Bank/U_Channel/U_TRD (U2_U_Bank_U_Channel_U_TRD#16.18), U_Bank/U_Channel/U_TRD (U2_U_Bank_U_Channel_U_TRD#17.18), U_Bank/U_Channel/U_TRD (U2_U_Bank_U_Channel_U_TRD#18.18), U_Bank/U_Channel/U_TRD (U2_U_Bank_U_Channel_U_TRD#19.18), U_Bank/U_Channel/U_TRD (U2_U_Bank_U_Channel_U_TRD#20.18), U_Bank/U_Channel/U_TRD (U2_U_Bank_U_Channel_U_TRD#21.18), U_Bank/U_Channel/U_TRD (U2_U_Bank_U_Channel_U_TRD#22.18), U_Bank/U_Channel/U_TRD (U2_U_Bank_U_Channel_U_TRD#23.18), U_Bank/U_Channel/U_TRD (U2_U_Bank_U_Channel_U_TRD#24.18), U_Bank/U_Channel/U_TRD (U2_U_Bank_U_Channel_U_TRD#25.18), U_Bank/U_Channel/U_TRD (U2_U_Bank_U_Channel_U_TRD#26.18), U_Bank/U_Channel/U_TRD (U2_U_Bank_U_Channel_U_TRD#27.18), U_Bank/U_Channel/U_TRD (U2_U_Bank_U_Channel_U_TRD#28.18), U_Bank/U_Channel/U_TRD (U2_U_Bank_U_Channel_U_TRD#29.18), U_Bank/U_Channel/U_TRD (U2_U_Bank_U_Channel_U_TRD#30.18), U_Bank/U_Channel/U_TRD (U2_U_Bank_U_Channel_U_TRD#31.18), U_Bank/U_Channel/U_TRD (U2_U_Bank_U_Channel_U_TRD#32.18), U_Bank/U_Channel/U_TRD (U2_U_Bank_U_Channel_U_TRD#33.18), U_Bank/U_Channel/U_TRD (U2_U_Bank_U_Channel_U_TRD#34.18), U_Bank/U_Channel/U_TRD (U2_U_Bank_U_Channel_U_TRD#35.18), U_Bank/U_Channel/U_TRD (U2_U_Bank_U_Channel_U_TRD#36.18), U_Bank/U_Channel/U_TRD (U2_U_Bank_U_Channel_U_TRD#37.18), U_Bank/U_Channel/U_TRD (U2_U_Bank_U_Channel_U_TRD#38.18), U_Bank/U_Channel/U_TRD (U2_U_Bank_U_Channel_U_TRD#39.18), U_Bank/U_Channel/U_TRD (U2_U_Bank_U_Channel_U_TRD#40.18), U_Bank/U_Channel/U_TRD (U2_U_Bank_U_Channel_U_TRD#41.18), U_Bank/U_Channel/U_TRD (U2_U_Bank_U_Channel_U_TRD#42.18), U_Bank/U_Channel/U_TRD (U2_U_Bank_U_Channel_U_TRD#43.18), U_Bank/U_Channel/U_TRD (U2_U_Bank_U_Channel_U_TRD#44.18), U_Bank/U_Channel/U_TRD (U2_U_Bank_U_Channel_U_TRD#45.18), U_Bank/U_Channel/U_TRD (U2_U_Bank_U_Channel_U_TRD#46.18), U_Bank/U_Channel/U_TRD (U2_U_Bank_U_Channel_U_TRD#47.18), U_Bank/U_Channel/U_TRD (U2_U_Bank_U_Channel_U_TRD#48.18)
NetIC8_34: MCU (IC8.34), U_Bank/U_Channel/U_TRD (U2_U_Bank_U_Channel_U_TRD#1.12), U_Bank/U_Channel/U_TRD (U2_U_Bank_U_Channel_U_TRD#2.12), U_Bank/U_Channel/U_TRD (U2_U_Bank_U_Channel_U_TRD#3.12), U_Bank/U_Channel/U_TRD (U2_U_Bank_U_Channel_U_TRD#4.12), U_Bank/U_Channel/U_TRD (U2_U_Bank_U_Channel_U_TRD#5.12), U_Bank/U_Channel/U_TRD (U2_U_Bank_U_Channel_U_TRD#6.12), U_Bank/U_Channel/U_TRD (U2_U_Bank_U_Channel_U_TRD#7.12), U_Bank/U_Channel/U_TRD (U2_U_Bank_U_Channel_U_TRD#8.12), U_Bank/U_Channel/U_TRD (U2_U_Bank_U_Channel_U_TRD#9.12), U_Bank/U_Channel/U_TRD (U2_U_Bank_U_Channel_U_TRD#10.12), U_Bank/U_Channel/U_TRD (U2_U_Bank_U_Channel_U_TRD#11.12), U_Bank/U_Channel/U_TRD (U2_U_Bank_U_Channel_U_TRD#12.12), U_Bank/U_Channel/U_TRD (U2_U_Bank_U_Channel_U_TRD#13.12), U_Bank/U_Channel/U_TRD (U2_U_Bank_U_Channel_U_TRD#14.12), U_Bank/U_Channel/U_TRD (U2_U_Bank_U_Channel_U_TRD#15.12), U_Bank/U_Channel/U_TRD (U2_U_Bank_U_Channel_U_TRD#16.12), U_Bank/U_Channel/U_TRD (U2_U_Bank_U_Channel_U_TRD#17.12), U_Bank/U_Channel/U_TRD (U2_U_Bank_U_Channel_U_TRD#18.12), U_Bank/U_Channel/U_TRD (U2_U_Bank_U_Channel_U_TRD#19.12), U_Bank/U_Channel/U_TRD (U2_U_Bank_U_Channel_U_TRD#20.12), U_Bank/U_Channel/U_TRD (U2_U_Bank_U_Channel_U_TRD#21.12), U_Bank/U_Channel/U_TRD (U2_U_Bank_U_Channel_U_TRD#22.12), U_Bank/U_Channel/U_TRD (U2_U_Bank_U_Channel_U_TRD#23.12), U_Bank/U_Channel/U_TRD (U2_U_Bank_U_Channel_U_TRD#24.12), U_Bank/U_Channel/U_TRD (U2_U_Bank_U_Channel_U_TRD#25.12), U_Bank/U_Channel/U_TRD (U2_U_Bank_U_Channel_U_TRD#26.12), U_Bank/U_Channel/U_TRD (U2_U_Bank_U_Channel_U_TRD#27.12), U_Bank/U_Channel/U_TRD (U2_U_Bank_U_Channel_U_TRD#28.12), U_Bank/U_Channel/U_TRD (U2_U_Bank_U_Channel_U_TRD#29.12), U_Bank/U_Channel/U_TRD (U2_U_Bank_U_Channel_U_TRD#30.12), U_Bank/U_Channel/U_TRD (U2_U_Bank_U_Channel_U_TRD#31.12), U_Bank/U_Channel/U_TRD (U2_U_Bank_U_Channel_U_TRD#32.12), U_Bank/U_Channel/U_TRD (U2_U_Bank_U_Channel_U_TRD#33.12), U_Bank/U_Channel/U_TRD (U2_U_Bank_U_Channel_U_TRD#34.12), U_Bank/U_Channel/U_TRD (U2_U_Bank_U_Channel_U_TRD#35.12), U_Bank/U_Channel/U_TRD (U2_U_Bank_U_Channel_U_TRD#36.12), U_Bank/U_Channel/U_TRD (U2_U_Bank_U_Channel_U_TRD#37.12), U_Bank/U_Channel/U_TRD (U2_U_Bank_U_Channel_U_TRD#38.12), U_Bank/U_Channel/U_TRD (U2_U_Bank_U_Channel_U_TRD#39.12), U_Bank/U_Channel/U_TRD (U2_U_Bank_U_Channel_U_TRD#40.12), U_Bank/U_Channel/U_TRD (U2_U_Bank_U_Channel_U_TRD#41.12), U_Bank/U_Channel/U_TRD (U2_U_Bank_U_Channel_U_TRD#42.12), U_Bank/U_Channel/U_TRD (U2_U_Bank_U_Channel_U_TRD#43.12), U_Bank/U_Channel/U_TRD (U2_U_Bank_U_Channel_U_TRD#44.12), U_Bank/U_Channel/U_TRD (U2_U_Bank_U_Channel_U_TRD#45.12), U_Bank/U_Channel/U_TRD (U2_U_Bank_U_Channel_U_TRD#46.12), U_Bank/U_Channel/U_TRD (U2_U_Bank_U_Channel_U_TRD#47.12), U_Bank/U_Channel/U_TRD (U2_U_Bank_U_Channel_U_TRD#48.12)
NetIC8_35: MCU (IC8.35), U_Bank/U_Channel/U_TRD (U2_U_Bank_U_Channel_U_TRD#1.14), U_Bank/U_Channel/U_TRD (U2_U_Bank_U_Channel_U_TRD#2.14), U_Bank/U_Channel/U_TRD (U2_U_Bank_U_Channel_U_TRD#3.14), U_Bank/U_Channel/U_TRD (U2_U_Bank_U_Channel_U_TRD#4.14), U_Bank/U_Channel/U_TRD (U2_U_Bank_U_Channel_U_TRD#5.14), U_Bank/U_Channel/U_TRD (U2_U_Bank_U_Channel_U_TRD#6.14), U_Bank/U_Channel/U_TRD (U2_U_Bank_U_Channel_U_TRD#7.14), U_Bank/U_Channel/U_TRD (U2_U_Bank_U_Channel_U_TRD#8.14), U_Bank/U_Channel/U_TRD (U2_U_Bank_U_Channel_U_TRD#9.14), U_Bank/U_Channel/U_TRD (U2_U_Bank_U_Channel_U_TRD#10.14), U_Bank/U_Channel/U_TRD (U2_U_Bank_U_Channel_U_TRD#11.14), U_Bank/U_Channel/U_TRD (U2_U_Bank_U_Channel_U_TRD#12.14), U_Bank/U_Channel/U_TRD (U2_U_Bank_U_Channel_U_TRD#13.14), U_Bank/U_Channel/U_TRD (U2_U_Bank_U_Channel_U_TRD#14.14), U_Bank/U_Channel/U_TRD (U2_U_Bank_U_Channel_U_TRD#15.14), U_Bank/U_Channel/U_TRD (U2_U_Bank_U_Channel_U_TRD#16.14), U_Bank/U_Channel/U_TRD (U2_U_Bank_U_Channel_U_TRD#17.14), U_Bank/U_Channel/U_TRD (U2_U_Bank_U_Channel_U_TRD#18.14), U_Bank/U_Channel/U_TRD (U2_U_Bank_U_Channel_U_TRD#19.14), U_Bank/U_Channel/U_TRD (U2_U_Bank_U_Channel_U_TRD#20.14), U_Bank/U_Channel/U_TRD (U2_U_Bank_U_Channel_U_TRD#21.14), U_Bank/U_Channel/U_TRD (U2_U_Bank_U_Channel_U_TRD#22.14), U_Bank/U_Channel/U_TRD (U2_U_Bank_U_Channel_U_TRD#23.14), U_Bank/U_Channel/U_TRD (U2_U_Bank_U_Channel_U_TRD#24.14), U_Bank/U_Channel/U_TRD (U2_U_Bank_U_Channel_U_TRD#25.14), U_Bank/U_Channel/U_TRD (U2_U_Bank_U_Channel_U_TRD#26.14), U_Bank/U_Channel/U_TRD (U2_U_Bank_U_Channel_U_TRD#27.14), U_Bank/U_Channel/U_TRD (U2_U_Bank_U_Channel_U_TRD#28.14), U_Bank/U_Channel/U_TRD (U2_U_Bank_U_Channel_U_TRD#29.14), U_Bank/U_Channel/U_TRD (U2_U_Bank_U_Channel_U_TRD#30.14), U_Bank/U_Channel/U_TRD (U2_U_Bank_U_Channel_U_TRD#31.14), U_Bank/U_Channel/U_TRD (U2_U_Bank_U_Channel_U_TRD#32.14), U_Bank/U_Channel/U_TRD (U2_U_Bank_U_Channel_U_TRD#33.14), U_Bank/U_Channel/U_TRD (U2_U_Bank_U_Channel_U_TRD#34.14), U_Bank/U_Channel/U_TRD (U2_U_Bank_U_Channel_U_TRD#35.14), U_Bank/U_Channel/U_TRD (U2_U_Bank_U_Channel_U_TRD#36.14), U_Bank/U_Channel/U_TRD (U2_U_Bank_U_Channel_U_TRD#37.14), U_Bank/U_Channel/U_TRD (U2_U_Bank_U_Channel_U_TRD#38.14), U_Bank/U_Channel/U_TRD (U2_U_Bank_U_Channel_U_TRD#39.14), U_Bank/U_Channel/U_TRD (U2_U_Bank_U_Channel_U_TRD#40.14), U_Bank/U_Channel/U_TRD (U2_U_Bank_U_Channel_U_TRD#41.14), U_Bank/U_Channel/U_TRD (U2_U_Bank_U_Channel_U_TRD#42.14), U_Bank/U_Channel/U_TRD (U2_U_Bank_U_Channel_U_TRD#43.14), U_Bank/U_Channel/U_TRD (U2_U_Bank_U_Channel_U_TRD#44.14), U_Bank/U_Channel/U_TRD (U2_U_Bank_U_Channel_U_TRD#45.14), U_Bank/U_Channel/U_TRD (U2_U_Bank_U_Channel_U_TRD#46.14), U_Bank/U_Channel/U_TRD (U2_U_Bank_U_Channel_U_TRD#47.14), U_Bank/U_Channel/U_TRD (U2_U_Bank_U_Channel_U_TRD#48.14)
NetIC8_36: MCU (IC8.36), U_Bank/U_Channel/U_TRD (U2_U_Bank_U_Channel_U_TRD#1.11), U_Bank/U_Channel/U_TRD (U2_U_Bank_U_Channel_U_TRD#2.11), U_Bank/U_Channel/U_TRD (U2_U_Bank_U_Channel_U_TRD#3.11), U_Bank/U_Channel/U_TRD (U2_U_Bank_U_Channel_U_TRD#4.11), U_Bank/U_Channel/U_TRD (U2_U_Bank_U_Channel_U_TRD#5.11), U_Bank/U_Channel/U_TRD (U2_U_Bank_U_Channel_U_TRD#6.11), U_Bank/U_Channel/U_TRD (U2_U_Bank_U_Channel_U_TRD#7.11), U_Bank/U_Channel/U_TRD (U2_U_Bank_U_Channel_U_TRD#8.11), U_Bank/U_Channel/U_TRD (U2_U_Bank_U_Channel_U_TRD#9.11), U_Bank/U_Channel/U_TRD (U2_U_Bank_U_Channel_U_TRD#10.11), U_Bank/U_Channel/U_TRD (U2_U_Bank_U_Channel_U_TRD#11.11), U_Bank/U_Channel/U_TRD (U2_U_Bank_U_Channel_U_TRD#12.11), U_Bank/U_Channel/U_TRD (U2_U_Bank_U_Channel_U_TRD#13.11), U_Bank/U_Channel/U_TRD (U2_U_Bank_U_Channel_U_TRD#14.11), U_Bank/U_Channel/U_TRD (U2_U_Bank_U_Channel_U_TRD#15.11), U_Bank/U_Channel/U_TRD (U2_U_Bank_U_Channel_U_TRD#16.11), U_Bank/U_Channel/U_TRD (U2_U_Bank_U_Channel_U_TRD#17.11), U_Bank/U_Channel/U_TRD (U2_U_Bank_U_Channel_U_TRD#18.11), U_Bank/U_Channel/U_TRD (U2_U_Bank_U_Channel_U_TRD#19.11), U_Bank/U_Channel/U_TRD (U2_U_Bank_U_Channel_U_TRD#20.11), U_Bank/U_Channel/U_TRD (U2_U_Bank_U_Channel_U_TRD#21.11), U_Bank/U_Channel/U_TRD (U2_U_Bank_U_Channel_U_TRD#22.11), U_Bank/U_Channel/U_TRD (U2_U_Bank_U_Channel_U_TRD#23.11), U_Bank/U_Channel/U_TRD (U2_U_Bank_U_Channel_U_TRD#24.11), U_Bank/U_Channel/U_TRD (U2_U_Bank_U_Channel_U_TRD#25.11), U_Bank/U_Channel/U_TRD (U2_U_Bank_U_Channel_U_TRD#26.11), U_Bank/U_Channel/U_TRD (U2_U_Bank_U_Channel_U_TRD#27.11), U_Bank/U_Channel/U_TRD (U2_U_Bank_U_Channel_U_TRD#28.11), U_Bank/U_Channel/U_TRD (U2_U_Bank_U_Channel_U_TRD#29.11), U_Bank/U_Channel/U_TRD (U2_U_Bank_U_Channel_U_TRD#30.11), U_Bank/U_Channel/U_TRD (U2_U_Bank_U_Channel_U_TRD#31.11), U_Bank/U_Channel/U_TRD (U2_U_Bank_U_Channel_U_TRD#32.11), U_Bank/U_Channel/U_TRD (U2_U_Bank_U_Channel_U_TRD#33.11), U_Bank/U_Channel/U_TRD (U2_U_Bank_U_Channel_U_TRD#34.11), U_Bank/U_Channel/U_TRD (U2_U_Bank_U_Channel_U_TRD#35.11), U_Bank/U_Channel/U_TRD (U2_U_Bank_U_Channel_U_TRD#36.11), U_Bank/U_Channel/U_TRD (U2_U_Bank_U_Channel_U_TRD#37.11), U_Bank/U_Channel/U_TRD (U2_U_Bank_U_Channel_U_TRD#38.11), U_Bank/U_Channel/U_TRD (U2_U_Bank_U_Channel_U_TRD#39.11), U_Bank/U_Channel/U_TRD (U2_U_Bank_U_Channel_U_TRD#40.11), U_Bank/U_Channel/U_TRD (U2_U_Bank_U_Channel_U_TRD#41.11), U_Bank/U_Channel/U_TRD (U2_U_Bank_U_Channel_U_TRD#42.11), U_Bank/U_Channel/U_TRD (U2_U_Bank_U_Channel_U_TRD#43.11), U_Bank/U_Channel/U_TRD (U2_U_Bank_U_Channel_U_TRD#44.11), U_Bank/U_Channel/U_TRD (U2_U_Bank_U_Channel_U_TRD#45.11), U_Bank/U_Channel/U_TRD (U2_U_Bank_U_Channel_U_TRD#46.11), U_Bank/U_Channel/U_TRD (U2_U_Bank_U_Channel_U_TRD#47.11), U_Bank/U_Channel/U_TRD (U2_U_Bank_U_Channel_U_TRD#48.11)
NetIC8_56: MCU (IC8.56), U_Bank/U_Channel (R1_U_Bank_U_Channel#1.1 R2_U_Bank_U_Channel#1.1), U_Bank/U_Channel (R1_U_Bank_U_Channel#2.1 R2_U_Bank_U_Channel#2.1), U_Bank/U_Channel (R1_U_Bank_U_Channel#3.1 R2_U_Bank_U_Channel#3.1), U_Bank/U_Channel (R1_U_Bank_U_Channel#4.1 R2_U_Bank_U_Channel#4.1), U_Bank/U_Channel (R1_U_Bank_U_Channel#5.1 R2_U_Bank_U_Channel#5.1), U_Bank/U_Channel (R1_U_Bank_U_Channel#6.1 R2_U_Bank_U_Channel#6.1), U_Bank/U_Channel (R1_U_Bank_U_Channel#7.1 R2_U_Bank_U_Channel#7.1), U_Bank/U_Channel (R1_U_Bank_U_Channel#8.1 R2_U_Bank_U_Channel#8.1), U_Bank/U_Channel (R1_U_Bank_U_Channel#9.1 R2_U_Bank_U_Channel#9.1), U_Bank/U_Channel (R1_U_Bank_U_Channel#10.1 R2_U_Bank_U_Channel#10.1), U_Bank/U_Channel (R1_U_Bank_U_Channel#11.1 R2_U_Bank_U_Channel#11.1), U_Bank/U_Channel (R1_U_Bank_U_Channel#12.1 R2_U_Bank_U_Channel#12.1), U_Bank/U_Channel (R1_U_Bank_U_Channel#13.1 R2_U_Bank_U_Channel#13.1), U_Bank/U_Channel (R1_U_Bank_U_Channel#14.1 R2_U_Bank_U_Channel#14.1), U_Bank/U_Channel (R1_U_Bank_U_Channel#15.1 R2_U_Bank_U_Channel#15.1), U_Bank/U_Channel (R1_U_Bank_U_Channel#16.1 R2_U_Bank_U_Channel#16.1), U_Bank/U_Channel (R1_U_Bank_U_Channel#17.1 R2_U_Bank_U_Channel#17.1), U_Bank/U_Channel (R1_U_Bank_U_Channel#18.1 R2_U_Bank_U_Channel#18.1), U_Bank/U_Channel (R1_U_Bank_U_Channel#19.1 R2_U_Bank_U_Channel#19.1), U_Bank/U_Channel (R1_U_Bank_U_Channel#20.1 R2_U_Bank_U_Channel#20.1), U_Bank/U_Channel (R1_U_Bank_U_Channel#21.1 R2_U_Bank_U_Channel#21.1), U_Bank/U_Channel (R1_U_Bank_U_Channel#22.1 R2_U_Bank_U_Channel#22.1), U_Bank/U_Channel (R1_U_Bank_U_Channel#23.1 R2_U_Bank_U_Channel#23.1), U_Bank/U_Channel (R1_U_Bank_U_Channel#24.1 R2_U_Bank_U_Channel#24.1)
NetIC8_61: HV_boost (LD1.2 R?#14.1 T1.1), MCU (IC8.61)
NetIC8_62: Pulser (SW5.1), MCU (IC8.62)
NetIC11_5: Pulser (IC11.5 LD2.2), U_Bank/U_Channel/U_TRD (IC17_U_Bank_U_Channel_U_TRD#1.2), U_Bank/U_Channel/U_TRD (IC17_U_Bank_U_Channel_U_TRD#2.2), U_Bank/U_Channel/U_TRD (IC17_U_Bank_U_Channel_U_TRD#3.2), U_Bank/U_Channel/U_TRD (IC17_U_Bank_U_Channel_U_TRD#4.2), U_Bank/U_Channel/U_TRD (IC17_U_Bank_U_Channel_U_TRD#5.2), U_Bank/U_Channel/U_TRD (IC17_U_Bank_U_Channel_U_TRD#6.2), U_Bank/U_Channel/U_TRD (IC17_U_Bank_U_Channel_U_TRD#7.2), U_Bank/U_Channel/U_TRD (IC17_U_Bank_U_Channel_U_TRD#8.2), U_Bank/U_Channel/U_TRD (IC17_U_Bank_U_Channel_U_TRD#9.2), U_Bank/U_Channel/U_TRD (IC17_U_Bank_U_Channel_U_TRD#10.2), U_Bank/U_Channel/U_TRD (IC17_U_Bank_U_Channel_U_TRD#11.2), U_Bank/U_Channel/U_TRD (IC17_U_Bank_U_Channel_U_TRD#12.2), U_Bank/U_Channel/U_TRD (IC17_U_Bank_U_Channel_U_TRD#13.2), U_Bank/U_Channel/U_TRD (IC17_U_Bank_U_Channel_U_TRD#14.2), U_Bank/U_Channel/U_TRD (IC17_U_Bank_U_Channel_U_TRD#15.2), U_Bank/U_Channel/U_TRD (IC17_U_Bank_U_Channel_U_TRD#16.2), U_Bank/U_Channel/U_TRD (IC17_U_Bank_U_Channel_U_TRD#17.2), U_Bank/U_Channel/U_TRD (IC17_U_Bank_U_Channel_U_TRD#18.2), U_Bank/U_Channel/U_TRD (IC17_U_Bank_U_Channel_U_TRD#19.2), U_Bank/U_Channel/U_TRD (IC17_U_Bank_U_Channel_U_TRD#20.2), U_Bank/U_Channel/U_TRD (IC17_U_Bank_U_Channel_U_TRD#21.2), U_Bank/U_Channel/U_TRD (IC17_U_Bank_U_Channel_U_TRD#22.2), U_Bank/U_Channel/U_TRD (IC17_U_Bank_U_Channel_U_TRD#23.2), U_Bank/U_Channel/U_TRD (IC17_U_Bank_U_Channel_U_TRD#24.2), U_Bank/U_Channel/U_TRD (IC17_U_Bank_U_Channel_U_TRD#25.2), U_Bank/U_Channel/U_TRD (IC17_U_Bank_U_Channel_U_TRD#26.2), U_Bank/U_Channel/U_TRD (IC17_U_Bank_U_Channel_U_TRD#27.2), U_Bank/U_Channel/U_TRD (IC17_U_Bank_U_Channel_U_TRD#28.2), U_Bank/U_Channel/U_TRD (IC17_U_Bank_U_Channel_U_TRD#29.2), U_Bank/U_Channel/U_TRD (IC17_U_Bank_U_Channel_U_TRD#30.2), U_Bank/U_Channel/U_TRD (IC17_U_Bank_U_Channel_U_TRD#31.2), U_Bank/U_Channel/U_TRD (IC17_U_Bank_U_Channel_U_TRD#32.2), U_Bank/U_Channel/U_TRD (IC17_U_Bank_U_Channel_U_TRD#33.2), U_Bank/U_Channel/U_TRD (IC17_U_Bank_U_Channel_U_TRD#34.2), U_Bank/U_Channel/U_TRD (IC17_U_Bank_U_Channel_U_TRD#35.2), U_Bank/U_Channel/U_TRD (IC17_U_Bank_U_Channel_U_TRD#36.2), U_Bank/U_Channel/U_TRD (IC17_U_Bank_U_Channel_U_TRD#37.2), U_Bank/U_Channel/U_TRD (IC17_U_Bank_U_Channel_U_TRD#38.2), U_Bank/U_Channel/U_TRD (IC17_U_Bank_U_Channel_U_TRD#39.2), U_Bank/U_Channel/U_TRD (IC17_U_Bank_U_Channel_U_TRD#40.2), U_Bank/U_Channel/U_TRD (IC17_U_Bank_U_Channel_U_TRD#41.2), U_Bank/U_Channel/U_TRD (IC17_U_Bank_U_Channel_U_TRD#42.2), U_Bank/U_Channel/U_TRD (IC17_U_Bank_U_Channel_U_TRD#43.2), U_Bank/U_Channel/U_TRD (IC17_U_Bank_U_Channel_U_TRD#44.2), U_Bank/U_Channel/U_TRD (IC17_U_Bank_U_Channel_U_TRD#45.2), U_Bank/U_Channel/U_TRD (IC17_U_Bank_U_Channel_U_TRD#46.2), U_Bank/U_Channel/U_TRD (IC17_U_Bank_U_Channel_U_TRD#47.2), U_Bank/U_Channel/U_TRD (IC17_U_Bank_U_Channel_U_TRD#48.2)
NetL6_2: Main (P5.1 P6.1), Pulser (P4.1), HV_boost (P1.1), DAC (R53.1), Regulators (L6.2)
NetR37_U_Bank_U_Channel_U_Switch#1_1: Main (SW6.2), U_Bank/U_Channel/U_Switch (R37_U_Bank_U_Channel_U_Switch#1.1), U_Bank/U_Channel/U_Switch (R37_U_Bank_U_Channel_U_Switch#2.1), U_Bank/U_Channel/U_Switch (R37_U_Bank_U_Channel_U_Switch#3.1), U_Bank/U_Channel/U_Switch (R37_U_Bank_U_Channel_U_Switch#4.1), U_Bank/U_Channel/U_Switch (R37_U_Bank_U_Channel_U_Switch#5.1), U_Bank/U_Channel/U_Switch (R37_U_Bank_U_Channel_U_Switch#6.1), U_Bank/U_Channel/U_Switch (R37_U_Bank_U_Channel_U_Switch#7.1), U_Bank/U_Channel/U_Switch (R37_U_Bank_U_Channel_U_Switch#8.1), U_Bank/U_Channel/U_Switch (R37_U_Bank_U_Channel_U_Switch#9.1), U_Bank/U_Channel/U_Switch (R37_U_Bank_U_Channel_U_Switch#10.1), U_Bank/U_Channel/U_Switch (R37_U_Bank_U_Channel_U_Switch#11.1), U_Bank/U_Channel/U_Switch (R37_U_Bank_U_Channel_U_Switch#12.1), U_Bank/U_Channel/U_Switch (R37_U_Bank_U_Channel_U_Switch#13.1), U_Bank/U_Channel/U_Switch (R37_U_Bank_U_Channel_U_Switch#14.1), U_Bank/U_Channel/U_Switch (R37_U_Bank_U_Channel_U_Switch#15.1), U_Bank/U_Channel/U_Switch (R37_U_Bank_U_Channel_U_Switch#16.1), U_Bank/U_Channel/U_Switch (R37_U_Bank_U_Channel_U_Switch#17.1), U_Bank/U_Channel/U_Switch (R37_U_Bank_U_Channel_U_Switch#18.1), U_Bank/U_Channel/U_Switch (R37_U_Bank_U_Channel_U_Switch#19.1), U_Bank/U_Channel/U_Switch (R37_U_Bank_U_Channel_U_Switch#20.1), U_Bank/U_Channel/U_Switch (R37_U_Bank_U_Channel_U_Switch#21.1), U_Bank/U_Channel/U_Switch (R37_U_Bank_U_Channel_U_Switch#22.1), U_Bank/U_Channel/U_Switch (R37_U_Bank_U_Channel_U_Switch#23.1), U_Bank/U_Channel/U_Switch (R37_U_Bank_U_Channel_U_Switch#24.1), U_Bank/U_Channel/U_Switch (R37_U_Bank_U_Channel_U_Switch#25.1), U_Bank/U_Channel/U_Switch (R37_U_Bank_U_Channel_U_Switch#26.1), U_Bank/U_Channel/U_Switch (R37_U_Bank_U_Channel_U_Switch#27.1), U_Bank/U_Channel/U_Switch (R37_U_Bank_U_Channel_U_Switch#28.1), U_Bank/U_Channel/U_Switch (R37_U_Bank_U_Channel_U_Switch#29.1), U_Bank/U_Channel/U_Switch (R37_U_Bank_U_Channel_U_Switch#30.1), U_Bank/U_Channel/U_Switch (R37_U_Bank_U_Channel_U_Switch#31.1), U_Bank/U_Channel/U_Switch (R37_U_Bank_U_Channel_U_Switch#32.1), U_Bank/U_Channel/U_Switch (R37_U_Bank_U_Channel_U_Switch#33.1), U_Bank/U_Channel/U_Switch (R37_U_Bank_U_Channel_U_Switch#34.1), U_Bank/U_Channel/U_Switch (R37_U_Bank_U_Channel_U_Switch#35.1), U_Bank/U_Channel/U_Switch (R37_U_Bank_U_Channel_U_Switch#36.1), U_Bank/U_Channel/U_Switch (R37_U_Bank_U_Channel_U_Switch#37.1), U_Bank/U_Channel/U_Switch (R37_U_Bank_U_Channel_U_Switch#38.1), U_Bank/U_Channel/U_Switch (R37_U_Bank_U_Channel_U_Switch#39.1), U_Bank/U_Channel/U_Switch (R37_U_Bank_U_Channel_U_Switch#40.1), U_Bank/U_Channel/U_Switch (R37_U_Bank_U_Channel_U_Switch#41.1), U_Bank/U_Channel/U_Switch (R37_U_Bank_U_Channel_U_Switch#42.1), U_Bank/U_Channel/U_Switch (R37_U_Bank_U_Channel_U_Switch#43.1), U_Bank/U_Channel/U_Switch (R37_U_Bank_U_Channel_U_Switch#44.1), U_Bank/U_Channel/U_Switch (R37_U_Bank_U_Channel_U_Switch#45.1), U_Bank/U_Channel/U_Switch (R37_U_Bank_U_Channel_U_Switch#46.1), U_Bank/U_Channel/U_Switch (R37_U_Bank_U_Channel_U_Switch#47.1), U_Bank/U_Channel/U_Switch (R37_U_Bank_U_Channel_U_Switch#48.1)
NetR?_U_Bank_U_Channel_U_Switch#3_1: Main (SW7.2), U_Bank/U_Channel/U_Switch (R?_U_Bank_U_Channel_U_Switch#3.1), U_Bank/U_Channel/U_Switch (R?_U_Bank_U_Channel_U_Switch#6.1), U_Bank/U_Channel/U_Switch (R?_U_Bank_U_Channel_U_Switch#9.1), U_Bank/U_Channel/U_Switch (R?_U_Bank_U_Channel_U_Switch#12.1), U_Bank/U_Channel/U_Switch (R?_U_Bank_U_Channel_U_Switch#15.1), U_Bank/U_Channel/U_Switch (R?_U_Bank_U_Channel_U_Switch#18.1), U_Bank/U_Channel/U_Switch (R?_U_Bank_U_Channel_U_Switch#21.1), U_Bank/U_Channel/U_Switch (R?_U_Bank_U_Channel_U_Switch#24.1), U_Bank/U_Channel/U_Switch (R?_U_Bank_U_Channel_U_Switch#27.1), U_Bank/U_Channel/U_Switch (R?_U_Bank_U_Channel_U_Switch#30.1), U_Bank/U_Channel/U_Switch (R?_U_Bank_U_Channel_U_Switch#33.1), U_Bank/U_Channel/U_Switch (R?_U_Bank_U_Channel_U_Switch#36.1), U_Bank/U_Channel/U_Switch (R?_U_Bank_U_Channel_U_Switch#39.1), U_Bank/U_Channel/U_Switch (R?_U_Bank_U_Channel_U_Switch#42.1), U_Bank/U_Channel/U_Switch (R?_U_Bank_U_Channel_U_Switch#45.1), U_Bank/U_Channel/U_Switch (R?_U_Bank_U_Channel_U_Switch#48.1), U_Bank/U_Channel/U_Switch (R?_U_Bank_U_Channel_U_Switch#51.1), U_Bank/U_Channel/U_Switch (R?_U_Bank_U_Channel_U_Switch#54.1), U_Bank/U_Channel/U_Switch (R?_U_Bank_U_Channel_U_Switch#57.1), U_Bank/U_Channel/U_Switch (R?_U_Bank_U_Channel_U_Switch#60.1), U_Bank/U_Channel/U_Switch (R?_U_Bank_U_Channel_U_Switch#63.1), U_Bank/U_Channel/U_Switch (R?_U_Bank_U_Channel_U_Switch#66.1), U_Bank/U_Channel/U_Switch (R?_U_Bank_U_Channel_U_Switch#69.1), U_Bank/U_Channel/U_Switch (R?_U_Bank_U_Channel_U_Switch#72.1), U_Bank/U_Channel/U_Switch (R?_U_Bank_U_Channel_U_Switch#75.1), U_Bank/U_Channel/U_Switch (R?_U_Bank_U_Channel_U_Switch#78.1), U_Bank/U_Channel/U_Switch (R?_U_Bank_U_Channel_U_Switch#81.1), U_Bank/U_Channel/U_Switch (R?_U_Bank_U_Channel_U_Switch#84.1), U_Bank/U_Channel/U_Switch (R?_U_Bank_U_Channel_U_Switch#87.1), U_Bank/U_Channel/U_Switch (R?_U_Bank_U_Channel_U_Switch#90.1), U_Bank/U_Channel/U_Switch (R?_U_Bank_U_Channel_U_Switch#93.1), U_Bank/U_Channel/U_Switch (R?_U_Bank_U_Channel_U_Switch#96.1), U_Bank/U_Channel/U_Switch (R?_U_Bank_U_Channel_U_Switch#99.1), U_Bank/U_Channel/U_Switch (R?_U_Bank_U_Channel_U_Switch#102.1), U_Bank/U_Channel/U_Switch (R?_U_Bank_U_Channel_U_Switch#105.1), U_Bank/U_Channel/U_Switch (R?_U_Bank_U_Channel_U_Switch#108.1), U_Bank/U_Channel/U_Switch (R?_U_Bank_U_Channel_U_Switch#111.1), U_Bank/U_Channel/U_Switch (R?_U_Bank_U_Channel_U_Switch#114.1), U_Bank/U_Channel/U_Switch (R?_U_Bank_U_Channel_U_Switch#117.1), U_Bank/U_Channel/U_Switch (R?_U_Bank_U_Channel_U_Switch#120.1), U_Bank/U_Channel/U_Switch (R?_U_Bank_U_Channel_U_Switch#123.1), U_Bank/U_Channel/U_Switch (R?_U_Bank_U_Channel_U_Switch#126.1), U_Bank/U_Channel/U_Switch (R?_U_Bank_U_Channel_U_Switch#129.1), U_Bank/U_Channel/U_Switch (R?_U_Bank_U_Channel_U_Switch#132.1), U_Bank/U_Channel/U_Switch (R?_U_Bank_U_Channel_U_Switch#135.1), U_Bank/U_Channel/U_Switch (R?_U_Bank_U_Channel_U_Switch#138.1), U_Bank/U_Channel/U_Switch (R?_U_Bank_U_Channel_U_Switch#141.1), U_Bank/U_Channel/U_Switch (R?_U_Bank_U_Channel_U_Switch#144.1)
OUTB: Main (SW6.1), DAC (IC19.4)
OUTC: HV_boost (SW2.3), DAC (IC19.7)
OUTD: Pulser (SW4.3), DAC (IC19.9)
W_A0: MCU (D6.2 IC?#3.8), U_Bank/U_Channel/U_Switch (IC16_U_Bank_U_Channel_U_Switch#41.5 LD4_U_Bank_U_Channel_U_Switch#41.2)
W_A0: MCU (D?#5.2 IC?#5.8), U_Bank/U_Channel/U_Switch (IC16_U_Bank_U_Channel_U_Switch#33.5 LD4_U_Bank_U_Channel_U_Switch#33.2)
W_A0: MCU (D?#13.2 IC?#7.8), U_Bank/U_Channel/U_Switch (IC16_U_Bank_U_Channel_U_Switch#25.5 LD4_U_Bank_U_Channel_U_Switch#25.2)
W_A0: MCU (D?#21.2 IC?#9.8), U_Bank/U_Channel/U_Switch (IC16_U_Bank_U_Channel_U_Switch#17.5 LD4_U_Bank_U_Channel_U_Switch#17.2)
W_A0: MCU (D?#29.2 IC?#11.8), U_Bank/U_Channel/U_Switch (IC16_U_Bank_U_Channel_U_Switch#9.5 LD4_U_Bank_U_Channel_U_Switch#9.2)
W_A0: MCU (D?#37.2 IC?#13.8), U_Bank/U_Channel/U_Switch (IC16_U_Bank_U_Channel_U_Switch#1.5 LD4_U_Bank_U_Channel_U_Switch#1.2)
W_A1: MCU (D5.2 IC?#3.6), U_Bank/U_Channel/U_Switch (IC16_U_Bank_U_Channel_U_Switch#43.5 LD4_U_Bank_U_Channel_U_Switch#43.2)
W_A1: MCU (D?#4.2 IC?#5.6), U_Bank/U_Channel/U_Switch (IC16_U_Bank_U_Channel_U_Switch#35.5 LD4_U_Bank_U_Channel_U_Switch#35.2)
W_A1: MCU (D?#12.2 IC?#7.6), U_Bank/U_Channel/U_Switch (IC16_U_Bank_U_Channel_U_Switch#27.5 LD4_U_Bank_U_Channel_U_Switch#27.2)
W_A1: MCU (D?#20.2 IC?#9.6), U_Bank/U_Channel/U_Switch (IC16_U_Bank_U_Channel_U_Switch#19.5 LD4_U_Bank_U_Channel_U_Switch#19.2)
W_A1: MCU (D?#28.2 IC?#11.6), U_Bank/U_Channel/U_Switch (IC16_U_Bank_U_Channel_U_Switch#11.5 LD4_U_Bank_U_Channel_U_Switch#11.2)
W_A1: MCU (D?#36.2 IC?#13.6), U_Bank/U_Channel/U_Switch (IC16_U_Bank_U_Channel_U_Switch#3.5 LD4_U_Bank_U_Channel_U_Switch#3.2)
W_A2: MCU (D4.2 IC?#3.4), U_Bank/U_Channel/U_Switch (IC16_U_Bank_U_Channel_U_Switch#45.5 LD4_U_Bank_U_Channel_U_Switch#45.2)
W_A2: MCU (D?#3.2 IC?#5.4), U_Bank/U_Channel/U_Switch (IC16_U_Bank_U_Channel_U_Switch#37.5 LD4_U_Bank_U_Channel_U_Switch#37.2)
W_A2: MCU (D?#11.2 IC?#7.4), U_Bank/U_Channel/U_Switch (IC16_U_Bank_U_Channel_U_Switch#29.5 LD4_U_Bank_U_Channel_U_Switch#29.2)
W_A2: MCU (D?#19.2 IC?#9.4), U_Bank/U_Channel/U_Switch (IC16_U_Bank_U_Channel_U_Switch#21.5 LD4_U_Bank_U_Channel_U_Switch#21.2)
W_A2: MCU (D?#27.2 IC?#11.4), U_Bank/U_Channel/U_Switch (IC16_U_Bank_U_Channel_U_Switch#13.5 LD4_U_Bank_U_Channel_U_Switch#13.2)
W_A2: MCU (D?#35.2 IC?#13.4), U_Bank/U_Channel/U_Switch (IC16_U_Bank_U_Channel_U_Switch#5.5 LD4_U_Bank_U_Channel_U_Switch#5.2)
W_A3: MCU (D3.2 IC?#3.2), U_Bank/U_Channel/U_Switch (IC16_U_Bank_U_Channel_U_Switch#47.5 LD4_U_Bank_U_Channel_U_Switch#47.2)
W_A3: MCU (D?#2.2 IC?#5.2), U_Bank/U_Channel/U_Switch (IC16_U_Bank_U_Channel_U_Switch#39.5 LD4_U_Bank_U_Channel_U_Switch#39.2)
W_A3: MCU (D?#10.2 IC?#7.2), U_Bank/U_Channel/U_Switch (IC16_U_Bank_U_Channel_U_Switch#31.5 LD4_U_Bank_U_Channel_U_Switch#31.2)
W_A3: MCU (D?#18.2 IC?#9.2), U_Bank/U_Channel/U_Switch (IC16_U_Bank_U_Channel_U_Switch#23.5 LD4_U_Bank_U_Channel_U_Switch#23.2)
W_A3: MCU (D?#26.2 IC?#11.2), U_Bank/U_Channel/U_Switch (IC16_U_Bank_U_Channel_U_Switch#15.5 LD4_U_Bank_U_Channel_U_Switch#15.2)
W_A3: MCU (D?#34.2 IC?#13.2), U_Bank/U_Channel/U_Switch (IC16_U_Bank_U_Channel_U_Switch#7.5 LD4_U_Bank_U_Channel_U_Switch#7.2)
W_B0: MCU (D9.2 IC?#4.11), U_Bank/U_Channel/U_Switch (IC16_U_Bank_U_Channel_U_Switch#42.5 LD4_U_Bank_U_Channel_U_Switch#42.2)
W_B0: MCU (D?#9.2 IC?#6.11), U_Bank/U_Channel/U_Switch (IC16_U_Bank_U_Channel_U_Switch#34.5 LD4_U_Bank_U_Channel_U_Switch#34.2)
W_B0: MCU (D?#17.2 IC?#8.11), U_Bank/U_Channel/U_Switch (IC16_U_Bank_U_Channel_U_Switch#26.5 LD4_U_Bank_U_Channel_U_Switch#26.2)
W_B0: MCU (D?#25.2 IC?#10.11), U_Bank/U_Channel/U_Switch (IC16_U_Bank_U_Channel_U_Switch#18.5 LD4_U_Bank_U_Channel_U_Switch#18.2)
W_B0: MCU (D?#33.2 IC?#12.11), U_Bank/U_Channel/U_Switch (IC16_U_Bank_U_Channel_U_Switch#10.5 LD4_U_Bank_U_Channel_U_Switch#10.2)
W_B0: MCU (D?#41.2 IC?#14.11), U_Bank/U_Channel/U_Switch (IC16_U_Bank_U_Channel_U_Switch#2.5 LD4_U_Bank_U_Channel_U_Switch#2.2)
W_B1: MCU (D8#2.2 IC?#4.13), U_Bank/U_Channel/U_Switch (IC16_U_Bank_U_Channel_U_Switch#44.5 LD4_U_Bank_U_Channel_U_Switch#44.2)
W_B1: MCU (D?#8.2 IC?#6.13), U_Bank/U_Channel/U_Switch (IC16_U_Bank_U_Channel_U_Switch#36.5 LD4_U_Bank_U_Channel_U_Switch#36.2)
W_B1: MCU (D?#16.2 IC?#8.13), U_Bank/U_Channel/U_Switch (IC16_U_Bank_U_Channel_U_Switch#28.5 LD4_U_Bank_U_Channel_U_Switch#28.2)
W_B1: MCU (D?#24.2 IC?#10.13), U_Bank/U_Channel/U_Switch (IC16_U_Bank_U_Channel_U_Switch#20.5 LD4_U_Bank_U_Channel_U_Switch#20.2)
W_B1: MCU (D?#32.2 IC?#12.13), U_Bank/U_Channel/U_Switch (IC16_U_Bank_U_Channel_U_Switch#12.5 LD4_U_Bank_U_Channel_U_Switch#12.2)
W_B1: MCU (D?#40.2 IC?#14.13), U_Bank/U_Channel/U_Switch (IC16_U_Bank_U_Channel_U_Switch#4.5 LD4_U_Bank_U_Channel_U_Switch#4.2)
W_B2: MCU (D7.2 IC?#4.15), U_Bank/U_Channel/U_Switch (IC16_U_Bank_U_Channel_U_Switch#46.5 LD4_U_Bank_U_Channel_U_Switch#46.2)
W_B2: MCU (D?#7.2 IC?#6.15), U_Bank/U_Channel/U_Switch (IC16_U_Bank_U_Channel_U_Switch#38.5 LD4_U_Bank_U_Channel_U_Switch#38.2)
W_B2: MCU (D?#15.2 IC?#8.15), U_Bank/U_Channel/U_Switch (IC16_U_Bank_U_Channel_U_Switch#30.5 LD4_U_Bank_U_Channel_U_Switch#30.2)
W_B2: MCU (D?#23.2 IC?#10.15), U_Bank/U_Channel/U_Switch (IC16_U_Bank_U_Channel_U_Switch#22.5 LD4_U_Bank_U_Channel_U_Switch#22.2)
W_B2: MCU (D?#31.2 IC?#12.15), U_Bank/U_Channel/U_Switch (IC16_U_Bank_U_Channel_U_Switch#14.5 LD4_U_Bank_U_Channel_U_Switch#14.2)
W_B2: MCU (D?#39.2 IC?#14.15), U_Bank/U_Channel/U_Switch (IC16_U_Bank_U_Channel_U_Switch#6.5 LD4_U_Bank_U_Channel_U_Switch#6.2)
W_B3: MCU (D8#1.2 IC?#4.17), U_Bank/U_Channel/U_Switch (IC16_U_Bank_U_Channel_U_Switch#48.5 LD4_U_Bank_U_Channel_U_Switch#48.2)
W_B3: MCU (D?#6.2 IC?#6.17), U_Bank/U_Channel/U_Switch (IC16_U_Bank_U_Channel_U_Switch#40.5 LD4_U_Bank_U_Channel_U_Switch#40.2)
W_B3: MCU (D?#14.2 IC?#8.17), U_Bank/U_Channel/U_Switch (IC16_U_Bank_U_Channel_U_Switch#32.5 LD4_U_Bank_U_Channel_U_Switch#32.2)
W_B3: MCU (D?#22.2 IC?#10.17), U_Bank/U_Channel/U_Switch (IC16_U_Bank_U_Channel_U_Switch#24.5 LD4_U_Bank_U_Channel_U_Switch#24.2)
W_B3: MCU (D?#30.2 IC?#12.17), U_Bank/U_Channel/U_Switch (IC16_U_Bank_U_Channel_U_Switch#16.5 LD4_U_Bank_U_Channel_U_Switch#16.2)